# Altium schematic sheet Fliege_Notch_Sim.SchDoc
size A; SheetNumber: 4; SheetTotal: 5
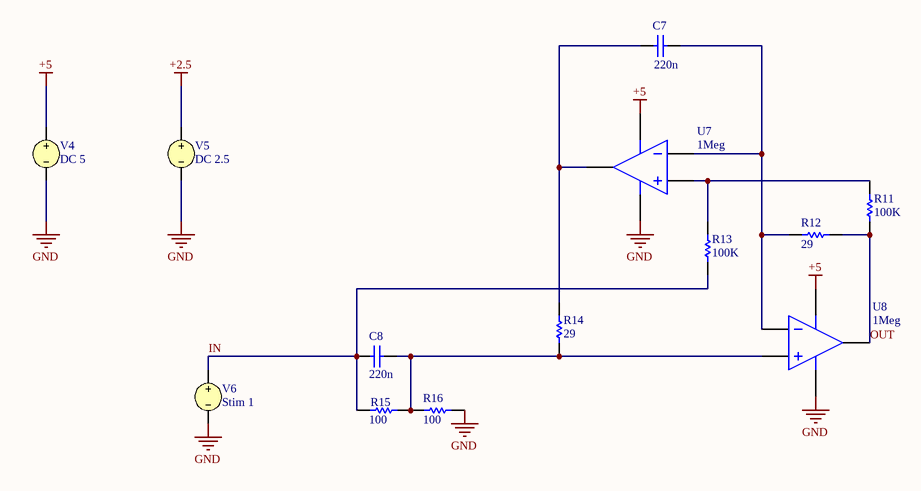
[diagram p0: Fliege_Notch_Sim.SchDoc]

## Parts
C7  value 220n  (hidden comment: Capacitor)
C8  value 220n  (hidden comment: Capacitor)
R11  value 100K  (hidden comment: Resistor)
R12  value 29  (hidden comment: Resistor)
R13  value 100K  (hidden comment: Resistor)
R14  value 29  (hidden comment: Resistor)
R15  value 100  (hidden comment: Resistor)
R16  value 100  (hidden comment: Resistor)
U7  GAIN: 1Meg  (hidden comment: Ideal Operational Amplifier)
U8  GAIN: 1Meg  (hidden comment: Ideal Operational Amplifier)
V4  DC 5
V5  DC 2.5
V6  Stim 1

## Nets
+2.5: V5.1
+5: U7.4(V+) U8.4(V+) V4.1
GND: R16.1 U7.5(V-) U8.5(V-) V4.2 V5.2 V6.2
IN: C8.1 R13.2 R15.1 V6.1
OUT: R11.2 R12.1 U8.3(OUT)
NetC7_1: C7.1 R14.1 U7.3(OUT)
NetC7_2: C7.2 R12.2 U7.1(IN-) U8.1(IN-)
NetC8_2: C8.2 R14.2 R15.2 R16.2 U8.2(IN+)
NetR11_1: R11.1 R13.1 U7.2(IN+)

## Library data of the parts
C7 C8 = Capacitor: SimulationGenericComponent: True
R11-R16 = Resistor: TC1: 0; SimulationGenericComponent: True; TC2: 0
U7 U8 = OpAmp with power terminals: SimulationGenericComponent: True
V4 = VSRC: Voltage Source; Note: PCB Footprint - Not required; AC Magnitude: 1; AC Phase: 0; Value: 5; Published: 8-Jun-2000; LatestRevisionDate: 17-Jul-2002; LatestRevisionNote: Re-released for DXP Platform.; PackageReference: Not Applicable; Publisher: Altium Limited
V5 = VSRC: Voltage Source; Note: PCB Footprint - Not required; AC Magnitude: 1; AC Phase: 0; Value: 2.5; Published: 8-Jun-2000; LatestRevisionDate: 17-Jul-2002; LatestRevisionNote: Re-released for DXP Platform.; PackageReference: Not Applicable; Publisher: Altium Limited
V6 = VSRC: Voltage Source; Note: PCB Footprint - Not required; AC Magnitude: 1; AC Phase: 0; DC Magnitude: 2.5; Frequency: 1Meg; Published: 8-Jun-2000; LatestRevisionDate: 17-Jul-2002; LatestRevisionNote: Re-released for DXP Platform.; PackageReference: Not Applicable; Publisher: Altium Limited; Offset: 0; Amplitude: 1; Delay: 0; Damping Factor: 0; Phase: 0